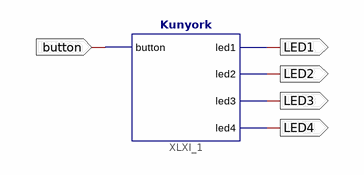
[diagram p0: schematic sheet 1]
// Xilinx ISE schematic ASD.sch (spartan6) as structural Verilog: 1 symbols, 5 ports
module ASD (
  input  button,
  output LED1,
  output LED2,
  output LED3,
  output LED4
);

  Kunyork XLXI_1 (.button(button), .led1(LED1), .led2(LED2), .led3(LED3), .led4(LED4));
endmodule
